# EAGLE design Arduino_S3v3_R2_b (EAGLE 9.6.2)
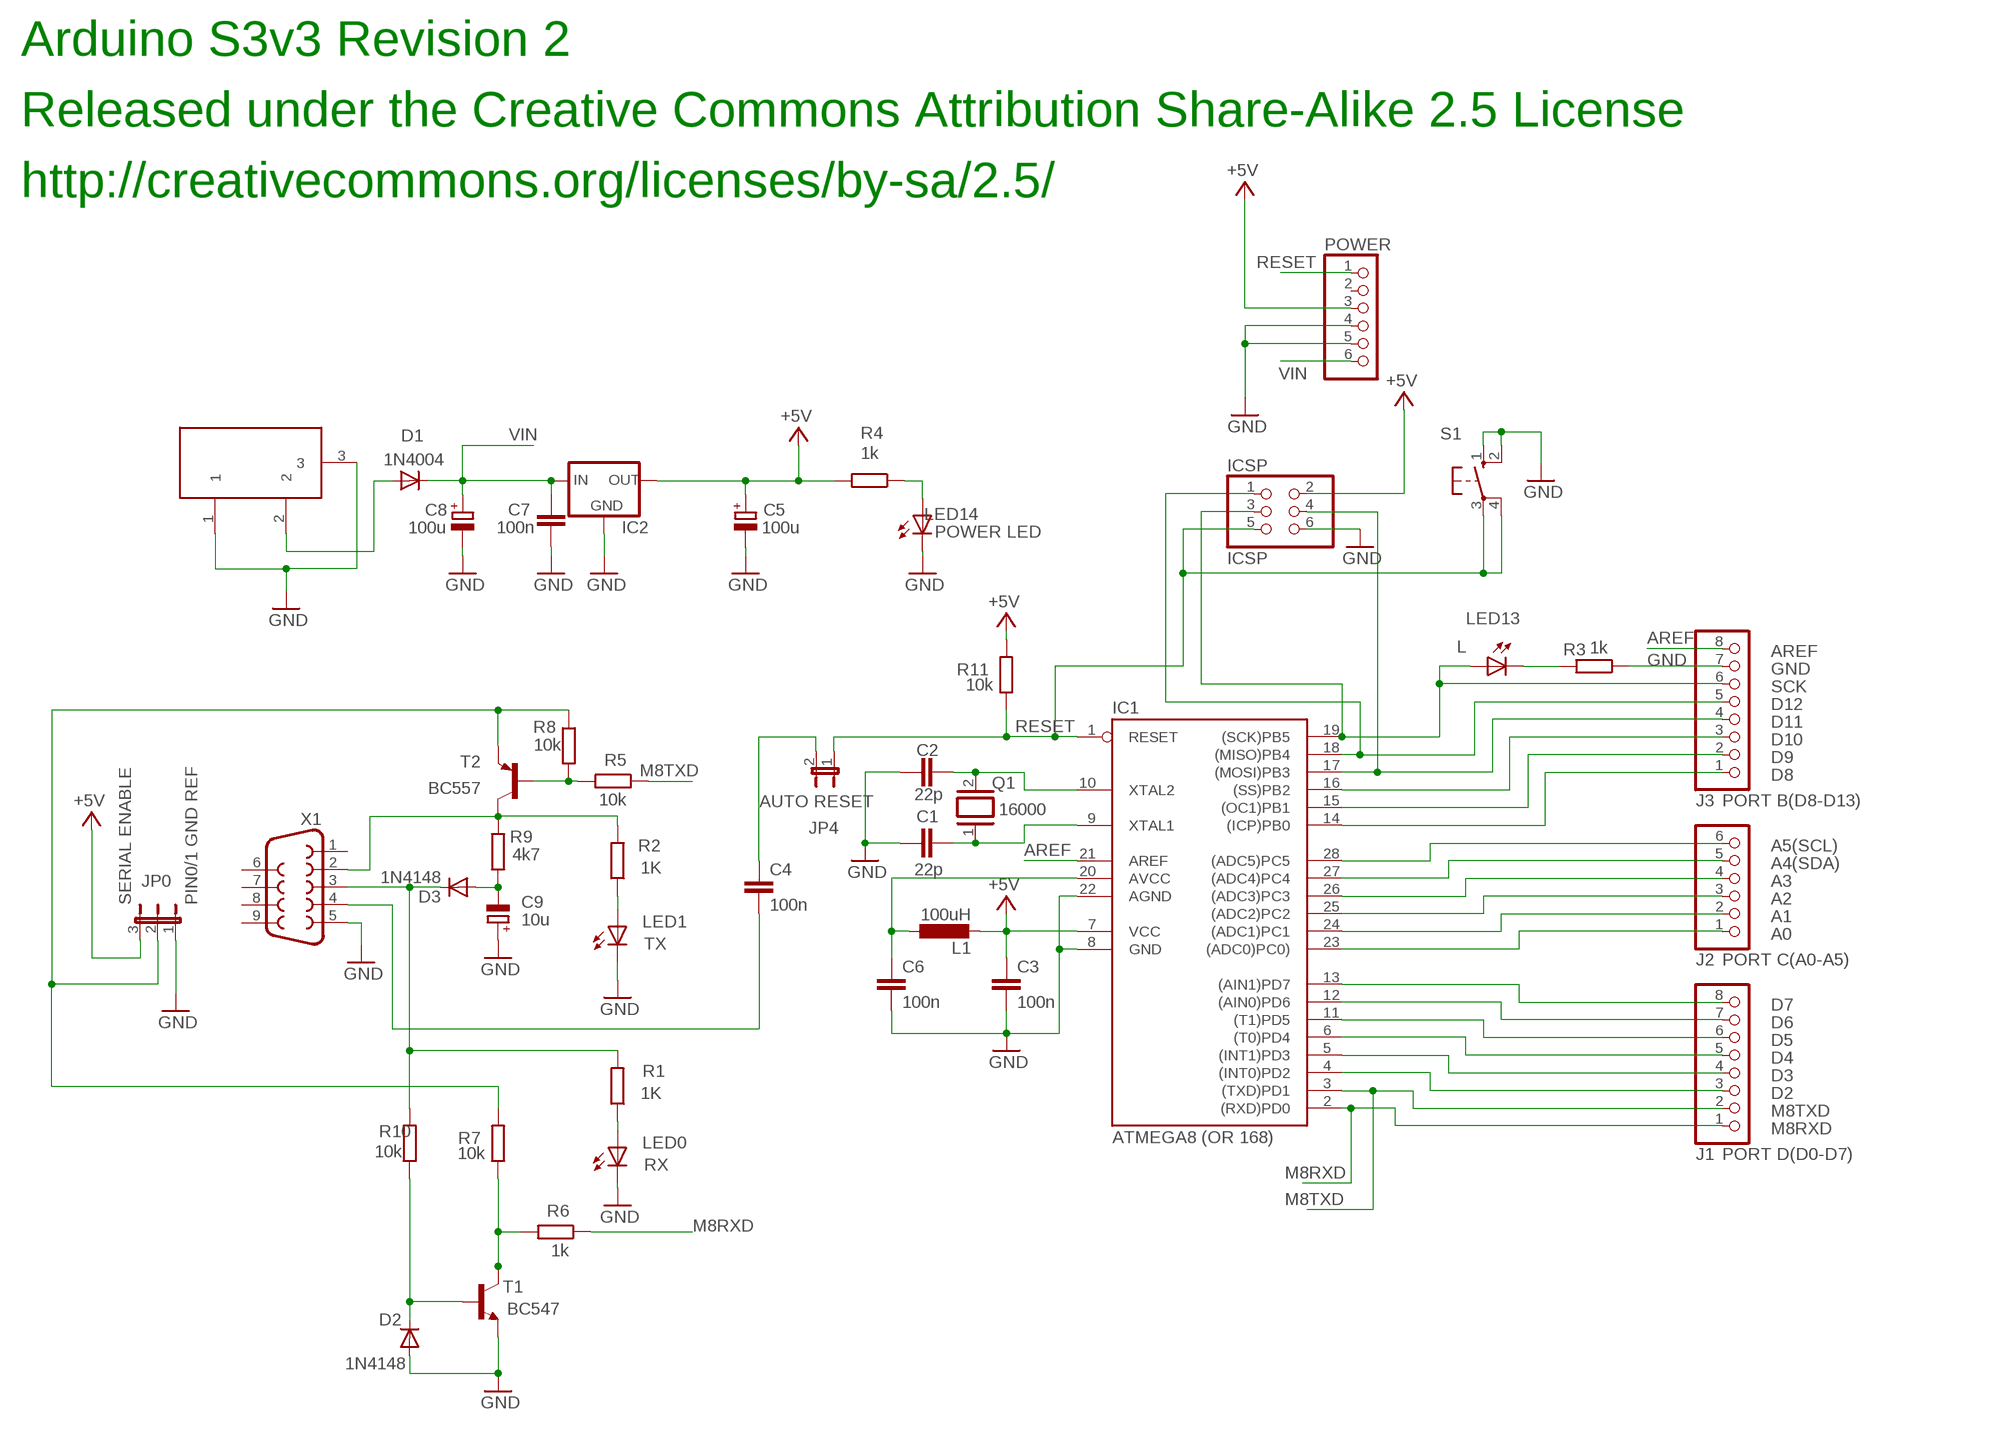
[diagram p0: schematic, sheet 1]

## Parts
C1  22p  C-EU025-024X044  [C025-024X044]
C2  22p  C-EU025-024X044  [C025-024X044]
C3  100n  C-EU050-025X075  [C050-025X075]
C4  100n  C-EU050-025X075  [C050-025X075]
C5  100u  CPOL-EUE3.5-8  [E3,5-8]
C6  100n  C-EU050-025X075  [C050-025X075]
C7  100n  C-EU050-025X075  [C050-025X075]
C8  100u  CPOL-EUE3.5-8  [E3,5-8]
C9  10u  CPOL-EUE5-6  [E5-6]
D1  1N4004  [DO41-10]
D2  1N4148  [DO35-10]
D3  1N4148  [DO35-10]
DC1  DC21MMX  [DC-21MM]
IC1  ATMEGA8 (OR 168)  AT90S4433P  [DIL28-3]
IC2  78XXL  [78XXL]
ICSP  ICSP  PINHD-2X3  [2X03]
J1  PORT D(D0-D7)  PINHD-1X8  [1X08]
J2  PORT C(A0-A5)  PINHD-1X6  [1X06]
J3  PORT B(D8-D13)  PINHD-1X8  [1X08]
JP0  JP2W  [JP2W]
JP4  AUTO RESET  JP1W  [JP1W]
L1  100uH  L-EU0204/5  [0204/5]
LED0  RX  LED3MM  [LED3MM]
LED1  TX  LED3MM  [LED3MM]
LED13  L  LED3MM  [LED3MM]
LED14  POWER LED  LED3MM  [LED3MM]
POWER  PINHD-1X6  [1X06]
Q1  16000  XTAL/S  [QS]
R1  1K  R-EU_0207/10  [0207/10]
R2  1K  R-EU_0207/10  [0207/10]
R3  1k  R-EU_0207/10  [0207/10]
R4  1k  R-EU_0207/10  [0207/10]
R5  10k  R-EU_0207/10  [0207/10]
R6  1k  R-EU_0207/10  [0207/10]
R7  10k  R-EU_0207/10  [0207/10]
R8  10k  R-EU_0207/10  [0207/10]
R9  4k7  R-EU_0207/10  [0207/10]
R10  10k  R-EU_0207/10  [0207/10]
R11  10k  R-EU_0207/10  [0207/10]
S1  10-XX  [B3F-10XX]
T1  BC547  [TO92]
T2  BC557  BC557B-PNP-TO92-EBC  [TO92-EBC]
X1  F09H  [F09H]

## Nets
+5V [power]: C3.1 C5.+ IC1.7(VCC) IC2.OUT ICSP.2 JP0.3 L1.2 POWER.3 R4.2 R11.2
A0: IC1.23((ADC0)PC0)) J2.1
A1: IC1.24((ADC1)PC1) J2.2
A2: IC1.25((ADC2)PC2) J2.3
A3: IC1.26((ADC3)PC3) J2.4
A4(SDA): IC1.27((ADC4)PC4) J2.5
A5(SCL): IC1.28((ADC5)PC5) J2.6
AREF: IC1.21(AREF) J3.8
D2: IC1.4((INT0)PD2) J1.3
D3: IC1.5((INT1)PD3) J1.4
D4: IC1.6((T0)PD4) J1.5
D5: IC1.11((T1)PD5) J1.6
D6: IC1.12((AIN0)PD6) J1.7
D7: IC1.13((AIN1)PD7) J1.8
D8: IC1.14((ICP)PB0) J3.1
D9: IC1.15((OC1)PB1) J3.2
D10: IC1.16((SS)PB2) J3.3
D11: IC1.17((MOSI)PB3) ICSP.4 J3.4
D12: IC1.18((MISO)PB4) ICSP.1 J3.5
GND: C1.1 C2.1 C3.2 C5.- C6.2 C7.1 C8.- C9.+ D2.A DC1.1 DC1.3 IC1.8(GND) IC1.22(AGND) IC2.GND ICSP.6 J3.7 JP0.1 LED0.K(C) LED1.K(C) LED14.K(C) POWER.4 POWER.5 R3.1 S1.1(S) S1.2(S1) T1.1(E) X1.5
M8RXD: IC1.2((RXD)PD0) J1.1 R6.1
M8TXD: IC1.3((TXD)PD1) J1.2 R5.1
N$2: C9.- D3.A R9.1
N$3: LED14.A R4.1
N$6: C1.2 IC1.9(XTAL1) Q1.1
N$7: C2.2 IC1.10(XTAL2) Q1.2
N$8: D1.A DC1.2
N$25: D3.C R1.2 R10.2 X1.3
N$26: R6.2 R7.1 T1.3(C)
N$27: R5.2 R8.2 T2.B
N$29: D2.C R10.1 T1.2(B)
N$31: LED13.K(C) R3.2
N$32: LED1.A R2.1
N$33: LED0.A R1.1
N$34: C4.1 JP4.2
N$38: C4.2 X1.4
N$39: R2.2 R9.2 T2.C X1.2
N$42 [power]: C6.1 IC1.20(AVCC) L1.1
RESET: IC1.1(RESET) ICSP.5 JP4.1 POWER.1 R11.1 S1.3(P) S1.4(P1)
SCK: IC1.19((SCK)PB5) ICSP.3 J3.6 LED13.A
SERIAL_VCC: JP0.2 R7.2 R8.1 T2.E
VIN [power]: C7.2 C8.+ D1.C IC2.IN POWER.6
Unconnected: POWER.2 X1.1 X1.6 X1.7 X1.8 X1.9

## Notes on the sheet
- Arduino S3v3 Revision 2
- Released under the Creative Commons Attribution Share-Alike 2.5 License
- http://creativecommons.org/licenses/by-sa/2.5/
- SERIAL ENABLE | PIN0/1 GND REF

## Library data of the parts
C1-C4 C6 C7 = rcl:C-EU: CAPACITOR, European symbol
C5 C8 C9 = rcl:CPOL-EU: POLARIZED CAPACITOR, European symbol
D1 = diode:1N4004: DIODE general purpose rectifier, 1 A
D2 D3 = diode:1N4148: DIODE high speed (Philips)
DC1 = powersupply:DC21MM
IC1 = atmel:AT90S4433: MICROCONTROLLER 4 Kbytes FLASH 128 bytes SRAM 256 bytes EEPROM UART 6-channel 10 bit ADC
IC2 = v-reg:78XXL: VOLTAGE REGULATOR
ICSP = pinhead:PINHD-2X3: PIN HEADER
J1 J3 = pinhead:PINHD-1X8: PIN HEADER
J2 POWER = pinhead:PINHD-1X6: PIN HEADER
JP0 = jumper:JP2W: JUMPER
JP4 = jumper:JP1W
L1 = rcl:L-EU: INDUCTOR, European symbol
LED0 LED1 LED13 LED14 = led:LED: LED OSRAM: - CHIPLED LG R971, LG N971, LY N971, LG Q971, LY Q971, LO R971, LY R971 LH N974, LH R974 LS Q976, LO Q976, LY Q976 LO Q996 - Hyper CHIPLED LW Q18S LB Q993, LB Q99A, LB R99A - SideLED LS A670, LO A670, LY A670, LG A670, LP A670 LB A673, LV A673, LT A673, LW A673 LH A674 LY A675 LS A676, LA A676, LO A676, LY A676, LW A676 LS A679, LY A679, LG A679 - Hyper Micro SIDELED® LS Y876, LA Y876, LO Y876, LY Y876 LT Y87S - SmartLED LW L88C, LW L88S LB L89C, LB L89S, LG L890 LS L89K, LO L89K, LY L89K LS L896, LA L896, LO L896, LY L896 - TOPLED LS T670, LO T670, LY T670, LG T670, LP T670 LSG T670, LSP T670, LSY T670, LOP T670, LYG T670 LG T671, LOG T671, LSG T671 LB T673, LV T673, LT T673, LW T673 LH T674 LS T676, LA T676, LO T676, LY T676, LB T676, LH T676, LSB T676, LW T676 LB T67C, LV T67C, LT T67C, LS T67K, LO T67K, LY T67K, LW E67C LS E67B, LA E67B, LO E67B, LY E67B, LB E67C, LV E67C, LT E67C LW T67C LS T679, LY T679, LG T679 LS T770, LO T770, LY T770, LG T770, LP T770 LB T773, LV T773, LT T773, LW T773 LH T774 LS E675, LA E675, LY E675, LS T675 LS T776, LA T776, LO T776, LY T776, LB T776 LHGB T686 LT T68C, LB T68C - Hyper Mini TOPLED® LB M676 - Mini TOPLED Santana® LG M470 LS M47K, LO M47K, LY M47K Source: http://www.osram.convergy.de/
Q1 = special:XTAL/S: CRYSTAL
R1-R11 = rcl:R-EU_: RESISTOR, European symbol
S1 = switch-omron:10-XX: OMRON SWITCH
T1 = transistor:BC547: NPN TRANSISTOR
T2 = transistor:*-PNP-: PNP Transistror
X1 = con-subd:F09: SUB-D

## Net classes
1 power: width 0.61 mm

## Board
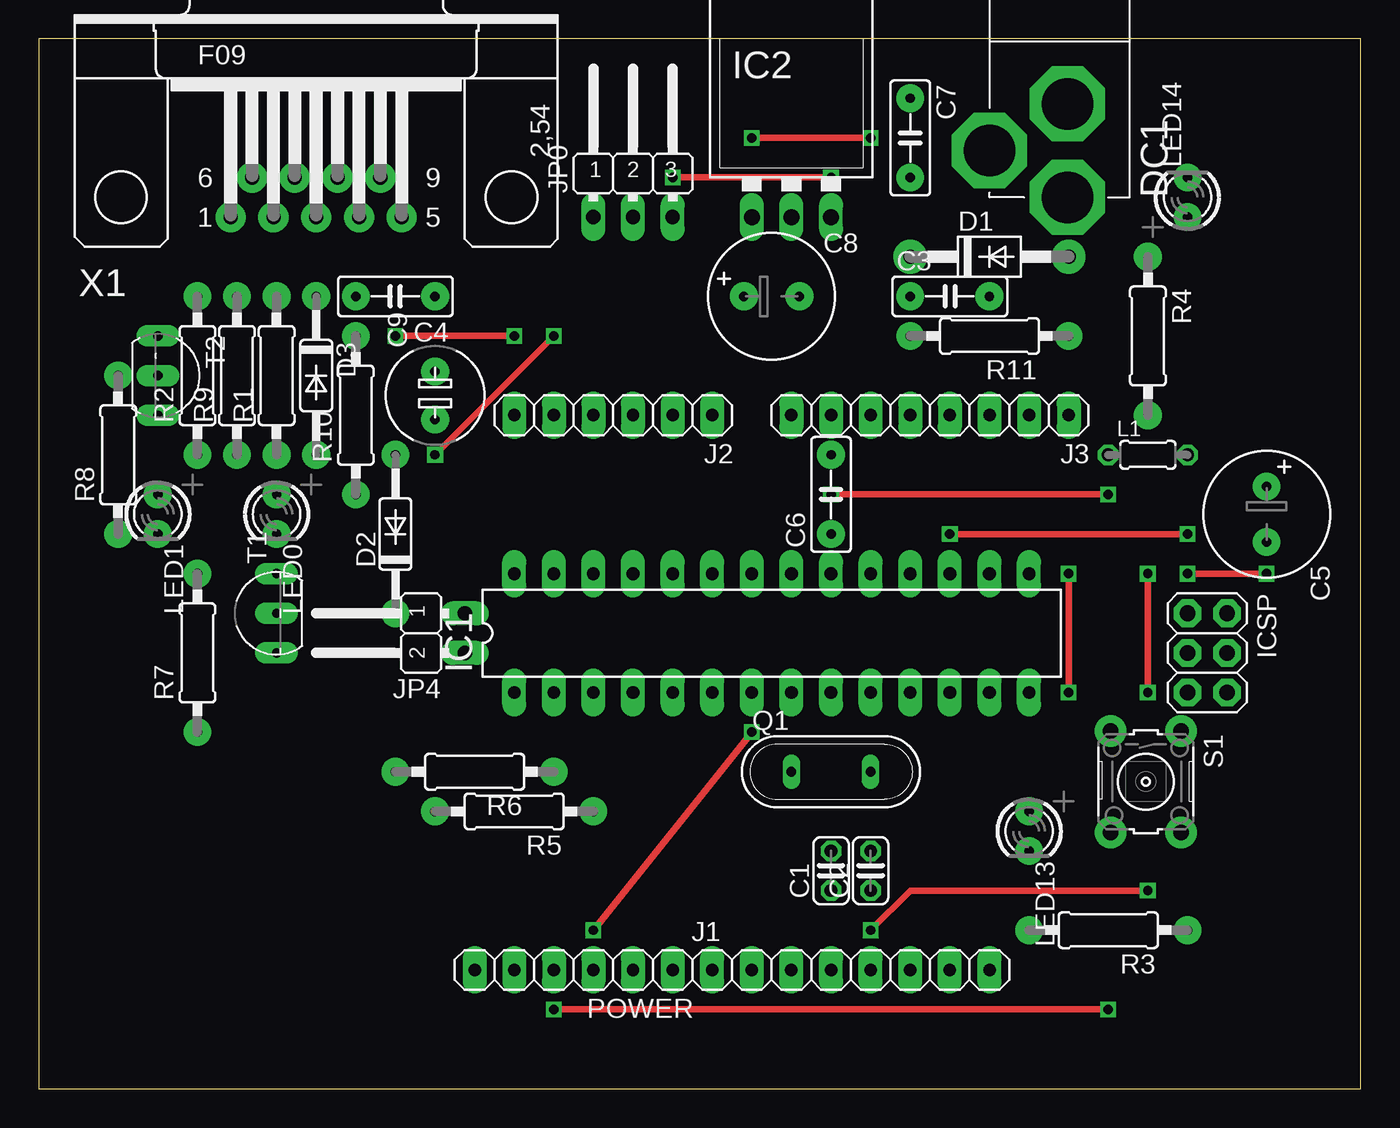
[diagram p1: board, top side]
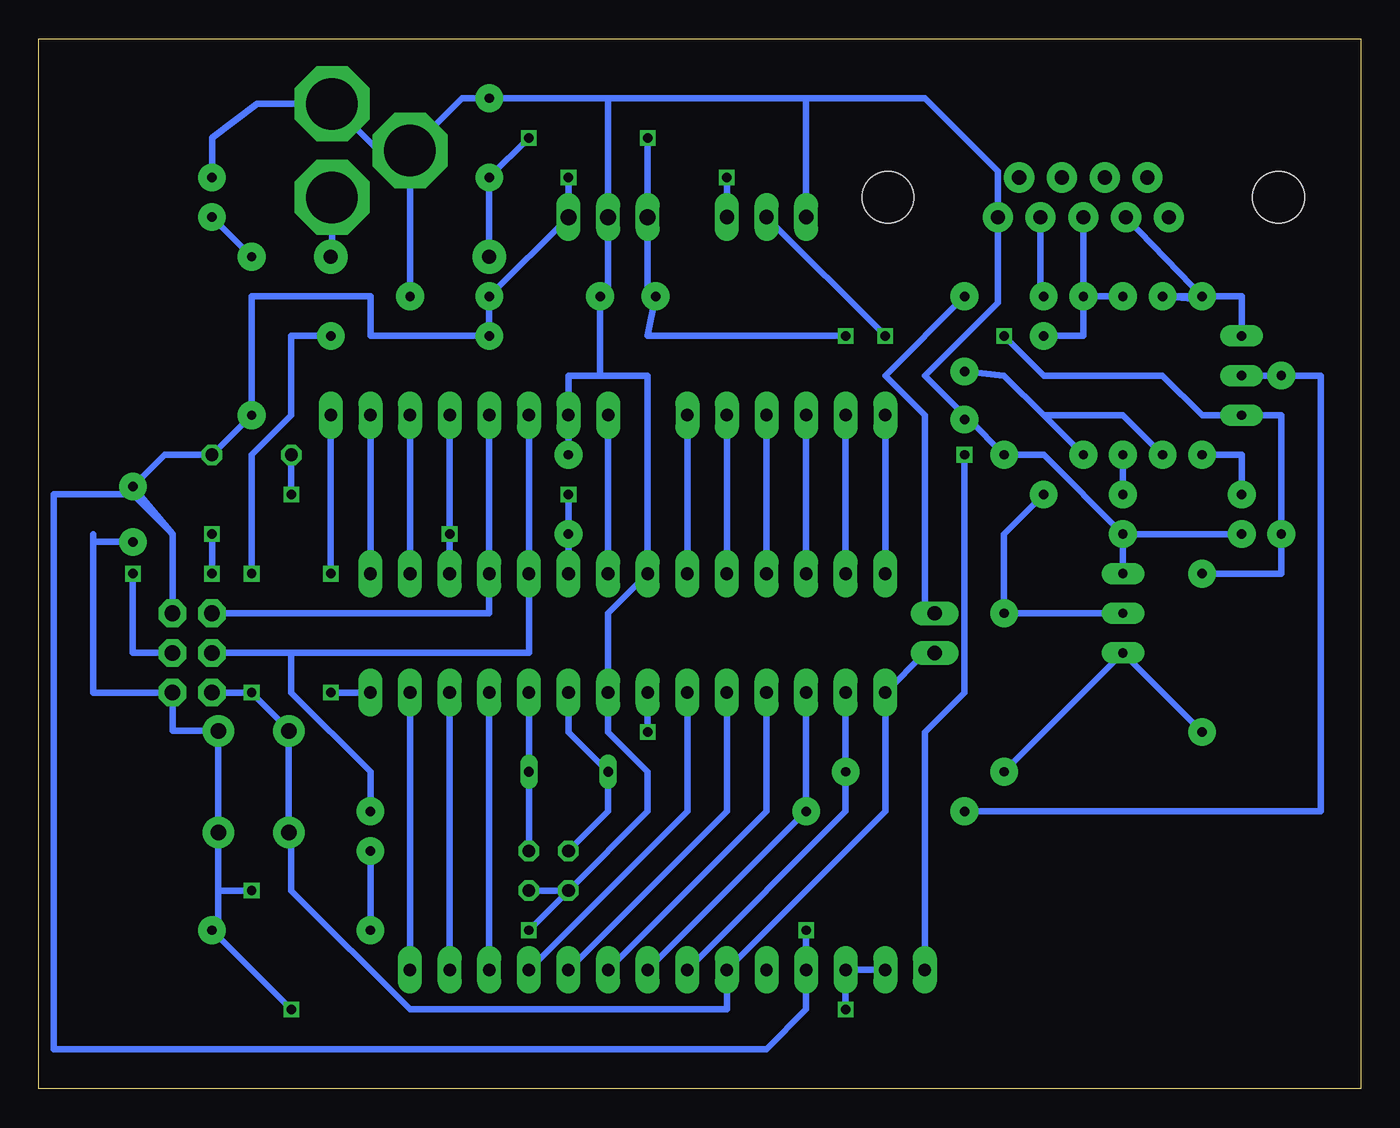
[diagram p2: board, bottom side, seen from below]

Size 84.76 x 67.3 mm. Coordinates in mm from the lower left corner, seen from the top.
Outline: 0,0 84.76,0 84.76,67.3 0,67.3 0,0
Copper layers (1*16): Top 0.035mm / dielectric 1.5mm / Bottom 0.035mm
Design rules "default": minimum track width 10mil, minimum drill 24mil, track to track 8mil, track to pad 8mil, pad to pad 8mil, via to via 8mil, smd to smd 8mil, copper to edge 40mil, drill to drill 8mil, minimum pad ring 10mil, minimum via ring 8mil, stop-mask expansion 4mil, vias tented up to drill 0mil, thermal gap 10mil

### Footprints (pad centres in the part's own frame; a part is rotated, then mirrored left to right if it is on the bottom)
C025-024X044 = drill 0.813 octagon: 1 -1.27,0; 2 1.27,0
C050-025X075 = drill 0.6 pad 1.778: 1 -2.54,0; 2 2.54,0
E3,5-8 = drill 0.6 pad 1.778: + -1.778,0; - 1.778,0
E5-6 = drill 0.6 pad 1.778: + -1.54,0; - 1.54,0
DO41-10 = drill 0.9 pad 2.159: A 5.08,0; C -5.08,0
DO35-10 = drill 0.6 pad 1.778: A 5.08,0; C -5.08,0
DC-21MM = drill 3.302 pad 4.826 octagon: 1 -5.08,-3.353; 2 -0.076,-6.35; 3 -0.076,-0.356
DIL28-3 = drill 0.813 pad 1.524 long: 1 -16.51,-3.81; 2 -13.97,-3.81; 3 -11.43,-3.81; 4 -8.89,-3.81; 5 -6.35,-3.81; 6 -3.81,-3.81; 7 -1.27,-3.81; 8 1.27,-3.81; 9 3.81,-3.81; 10 6.35,-3.81; 11 8.89,-3.81; 12 11.43,-3.81; 13 13.97,-3.81; 14 16.51,-3.81; 15 16.51,3.81; 16 13.97,3.81; 17 11.43,3.81; 18 8.89,3.81; 19 6.35,3.81; 20 3.81,3.81; 21 1.27,3.81; 22 -1.27,3.81; 23 -3.81,3.81; 24 -6.35,3.81; 25 -8.89,3.81; 26 -11.43,3.81; 27 -13.97,3.81; 28 -16.51,3.81
78XXL = drill 1.016 long: GND 0,-3.81; IN -2.54,-3.81; OUT 2.54,-3.81
2X03 = drill 1 pad 1.778 octagon: 1 -2.54,-1.27; 2 -2.54,1.27; 3 0,-1.27; 4 0,1.27; 5 2.54,-1.27; 6 2.54,1.27
1X08 = drill 0.8 pad 1.524 long: 1 -8.89,0; 2 -6.35,0; 3 -3.81,0; 4 -1.27,0; 5 1.27,0; 6 3.81,0; 7 6.35,0; 8 8.89,0
1X06 = drill 0.8 pad 1.524 long: 1 -6.35,0; 2 -3.81,0; 3 -1.27,0; 4 1.27,0; 5 3.81,0; 6 6.35,0
JP2W = drill 0.914 pad 1.524 long: 1 -2.54,-1.27; 2 0,-1.27; 3 2.54,-1.27
JP1W = drill 0.914 pad 1.524 long: 1 -1.27,-1.905; 2 1.27,-1.905
0204/5 = drill 0.813 octagon: 1 -2.54,0; 2 2.54,0
LED3MM = drill 0.6 pad 1.778: A -1.27,0; K 1.27,0
QS = drill 0.61 long: 1 -2.54,0; 2 2.54,0
0207/10 = drill 0.6 pad 1.778: 1 -5.08,0; 2 5.08,0
B3F-10XX = drill 1 pad 2.032: 1 -3.251,2.261; 2 3.251,2.261; 3 -3.251,-2.261; 4 3.251,-2.261
TO92 = drill 0.6 pad 1.372 long: 1 2.54,0; 2 0,0; 3 -2.54,0
TO92-EBC = drill 0.6 pad 1.372 long: B 0,-1.27; C -2.54,-1.27; E 2.54,-1.27
F09H = drill 0.9 pad 1.93: 1 -5.486,-1.27; 2 -2.743,-1.27; 3 0,-1.27; 4 2.743,-1.27; 5 5.486,-1.27; 6 -4.115,1.27; 7 -1.372,1.27; 8 1.372,1.27; 9 4.115,1.27 | hole 3.302: -12.522,0; 12.522,0

### Placement (x,y rotation side)
C1  50.8,13.97 90 top
C2  53.34,13.97 90 top
C3  58.42,50.8 0 top
C4  22.86,50.8 180 top
C5  78.74,36.83 270 top
C6  50.8,38.1 90 top
C7  55.88,60.96 270 top
C8  46.99,50.8 0 top
C9  25.4,44.45 90 top
D1  60.96,53.34 0 top
D2  22.86,35.56 90 top
D3  17.78,45.72 270 top
DC1  66.04,63.5 0 top
IC1  46.99,29.21 0 top
IC2  48.26,59.69 0 top
ICSP  74.93,27.94 270 top
J1  52.07,7.62 0 top
J2  36.83,43.18 180 top
J3  57.15,43.18 180 top
JP0  38.1,57.15 0 top
JP4  25.4,29.21 90 top
L1  71.12,40.64 0 top
LED0  15.24,36.83 270 top
LED1  7.62,36.83 270 top
LED13  63.5,16.51 270 top
LED14  73.66,57.15 90 top
POWER  34.29,7.62 180 top
Q1  50.8,20.32 0 top
R1  15.24,45.72 90 top
R2  10.16,45.72 90 top
R3  68.58,10.16 180 top
R4  71.12,48.26 270 top
R5  30.48,17.78 180 top
R6  27.94,20.32 180 top
R7  10.16,27.94 90 top
R8  5.08,40.64 90 top
R9  12.7,45.72 90 top
R10  20.32,43.18 90 top
R11  60.96,48.26 180 top
S1  70.99,19.68 270 top
T1  15.24,30.48 90 top
T2  8.89,45.72 270 top
X1  17.78,57.15 0 top

### Tracks (layer width: path | path; a pad name or v marks a point on that pad's centre or on a via)
+5V  (via drill 0.6)
  Top 0.406: v40.64,58.42 v50.8,58.42 | v45.72,22.86 v35.56,10.16
  Bottom 0.406: 76.2,35.56 C5.+ 76.71,40.64 L1.2 R4.2 71.12,50.8 63.5,50.8 63.5,48.26 R11.2 C3.1 IC2.OUT v50.8,58.42 | 76.2,35.56 ICSP.2 | JP0.3 v40.64,58.42 | 76.2,35.56 78.74,38.1 83.82,38.1 83.82,2.54 38.1,2.54 35.56,5.08 POWER.3 v35.56,10.16 | IC1.7 v45.72,22.86
A0
  Bottom 0.406: J2.1 IC1.23
A1
  Bottom 0.406: J2.2 IC1.24
A2
  Bottom 0.406: J2.3 IC1.25
A3
  Bottom 0.406: J2.4 IC1.26
A4(SDA)
  Bottom 0.406: J2.5 IC1.27
A5(SCL)
  Bottom 0.406: J2.6 IC1.28
AREF
  Bottom 0.406: J3.8 IC1.21
D2
  Bottom 0.406: J1.3 38.1,17.78 IC1.4
D3
  Bottom 0.406: J1.4 40.64,17.78 IC1.5
D4
  Bottom 0.406: J1.5 43.18,17.78 IC1.6
D5
  Bottom 0.406: IC1.11 J1.6
D6
  Bottom 0.406: IC1.12 J1.7
D7
  Bottom 0.406: IC1.13 J1.8
D8  (via drill 0.6)
  Top 0.406: v66.04,25.4 v66.04,33.02
  Bottom 0.406: IC1.14 v66.04,25.4 | v66.04,33.02 J3.1
D9
  Bottom 0.406: J3.2 IC1.15
D10
  Bottom 0.406: J3.3 IC1.16
D11  (via drill 0.6)
  Top 0.406: v73.66,35.56 v58.42,35.56 | v73.66,33.02 v78.74,33.02
  Bottom 0.406: IC1.17 v58.42,35.56 J3.4 | v73.66,35.56 v73.66,33.02 | v78.74,33.02 78.74,27.94 ICSP.4
D12
  Bottom 0.406: J3.5 IC1.18 55.88,30.48 ICSP.1
GND  (via drill 0.6)
  Top 0.406: v33.02,5.08 v68.58,5.08 | v53.34,10.16 55.88,12.7 v71.12,12.7
  Bottom 0.406: C6.2 J3.7 50.8,45.72 48.77,45.72 | 48.77,45.72 45.72,45.72 IC1.22 48.26,30.48 IC1.8 48.26,22.86 45.72,20.32 45.72,17.78 C1.1 | 48.77,45.72 C8.- 48.26,50.8 IC2.GND 48.26,63.5 | 78.74,35.56 C5.- 81.28,35.05 | 81.28,35.05 81.28,35.56 | 81.28,35.05 81.28,25.4 ICSP.6 76.2,22.94 S1.1 S1.2 73.25,12.7 | 73.25,12.7 73.25,10.16 R3.1 v68.58,5.08 | DC1.1 57.61,63.5 C7.1 48.26,63.5 | DC1.1 62.97,60.15 DC1.3 70.76,63.14 73.66,60.96 LED14.K | DC1.1 C3.2 | C2.1 C1.1 | JP0.1 35.56,63.5 | 35.56,63.5 48.26,63.5 | 35.56,63.5 27.94,63.5 23.27,58.83 X1.5 23.27,50.39 27.94,45.72 25.4,43.18 C9.+ 25.13,42.91 D2.A 20.32,40.64 LED0.K | LED1.K LED0.K | POWER.5 POWER.4 v33.02,5.08 | C1.1 v53.34,10.16 | v71.12,12.7 73.25,12.7 | T1.1 LED0.K
M8RXD
  Bottom 0.406: IC1.2 R6.1 33.02,17.78 J1.1
M8TXD
  Bottom 0.406: IC1.3 R5.1 J1.2
N$2
  Bottom 0.406: R9.1 15.24,43.18 20.32,43.18 | D3.A 20.32,43.18 | 20.32,43.18 22.86,45.72 C9.-
N$3
  Bottom 0.406: LED14.A R4.1
N$6
  Bottom 0.406: IC1.9 50.8,22.86 Q1.1 48.26,17.78 C1.2
N$7
  Bottom 0.406: IC1.10 Q1.2 C2.2
N$8
  Bottom 0.406: DC1.2 65.96,53.42 D1.A
N$25
  Bottom 0.406: R1.2 D3.C | D3.C X1.3 | D3.C 17.78,48.26 R10.2
N$26
  Bottom 0.406: R7.1 T1.3 R6.2
N$27
  Bottom 0.406: T2.B R8.2 2.54,45.72 2.54,17.78 R5.2
N$29
  Bottom 0.406: T1.2 D2.C 22.86,35.56 R10.1
N$31
  Bottom 0.406: LED13.K R3.2
N$32
  Bottom 0.406: LED1.A 7.62,40.64 R2.1
N$33
  Bottom 0.406: LED0.A R1.1
N$34
  Bottom 0.406: JP4.2 27.94,30.48 27.94,43.18 30.48,45.72 C4.1
N$38
  Bottom 0.406: X1.4 20.52,51 C4.2
N$39
  Bottom 0.406: X1.2 9.96,50.6 R9.2 R2.2 7.62,50.8 T2.C
N$42  (via drill 0.6)
  Top 0.406: v50.8,38.1 v68.58,38.1
  Bottom 0.406: IC1.20 C6.1 v50.8,38.1 | v68.58,38.1 L1.1
RESET  (via drill 0.6)
  Top 0.406: v71.12,25.4 v71.12,33.02
  Bottom 0.406: R11.1 68.58,48.26 68.58,43.18 71.12,40.64 v71.12,33.02 | JP4.1 27.94,27.94 IC1.1 30.48,17.78 POWER.1 40.64,5.08 60.96,5.08 68.58,12.7 68.58,16.28 S1.4 S1.3 68.73,23.01 v71.12,25.4 ICSP.5
SCK
  Bottom 0.406: J3.6 IC1.19 53.34,27.94 68.58,27.94 | 68.58,27.94 ICSP.3 | LED13.A 63.5,20.32 68.58,25.4 68.58,27.94
SERIAL_VCC  (via drill 0.6)
  Top 0.406: v22.86,48.26 v30.48,48.26
  Bottom 0.406: R7.2 5.08,33.02 R8.1 5.08,43.18 T2.E 10.16,43.18 12.7,45.72 20.32,45.72 v22.86,48.26 | v30.48,48.26 JP0.2
VIN  (via drill 0.6)
  Top 0.406: v53.34,60.96 v45.72,60.96 | v25.4,40.64 v33.02,48.26
  Bottom 0.406: D1.C C7.2 v53.34,60.96 | v45.72,60.96 IC2.IN 45.72,50.8 C8.+ 45.72,48.26 v33.02,48.26 | POWER.6 27.94,22.86 25.4,25.4 v25.4,40.64